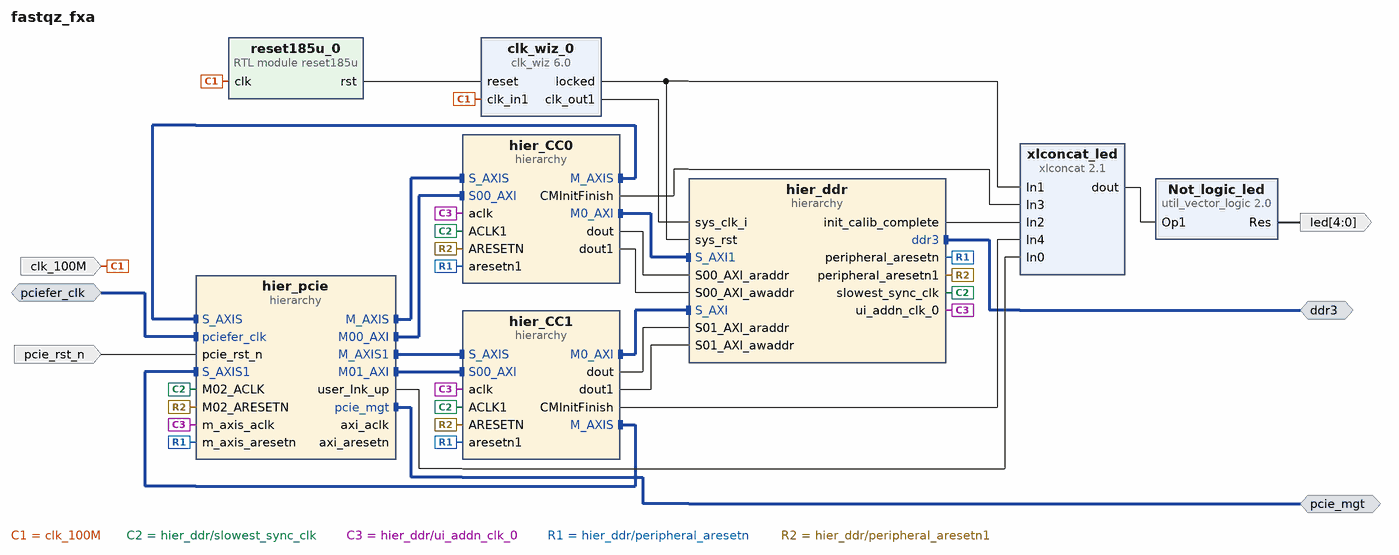
[diagram p0: block diagram of the top level]
# Vivado block design fastqz_fxa, xc7k420tiffg901-2L, Vivado 2018.2
create_bd_design fastqz_fxa

create_bd_intf_port -mode Slave -vlnv xilinx.com:interface:diff_clock_rtl:1.0 pciefer_clk
set_property -dict {CONFIG.FREQ_HZ 100000000} [get_bd_intf_ports pciefer_clk]
create_bd_intf_port -mode Master -vlnv xilinx.com:interface:pcie_7x_mgt_rtl:1.0 pcie_mgt
create_bd_intf_port -mode Master -vlnv xilinx.com:interface:ddrx_rtl:1.0 ddr3
create_bd_port -dir I -type clk clk_100M
create_bd_port -dir I -type rst pcie_rst_n
create_bd_port -dir O -from 4 -to 0 led

create_bd_cell -type ip -vlnv xilinx.com:ip:clk_wiz:6.0 clk_wiz_0
set_property -dict [list \
  CONFIG.CLKOUT1_REQUESTED_OUT_FREQ 200.000 \
  CONFIG.USE_LOCKED true \
  CONFIG.USE_RESET true \
  CONFIG.MMCM_DIVCLK_DIVIDE 1 \
  CONFIG.MMCM_CLKOUT0_DIVIDE_F 5.000 \
  CONFIG.CLKOUT1_JITTER 114.829 \
] [get_bd_cells clk_wiz_0]
create_bd_cell -type module -reference reset185u reset185u_0
create_bd_cell -type hier hier_ddr
create_bd_cell -type hier hier_CC0
create_bd_cell -type hier hier_pcie
create_bd_cell -type ip -vlnv xilinx.com:ip:xlconcat:2.1 xlconcat_led
set_property -dict {CONFIG.NUM_PORTS 5} [get_bd_cells xlconcat_led]
create_bd_cell -type ip -vlnv xilinx.com:ip:util_vector_logic:2.0 Not_logic_led
set_property -dict {CONFIG.C_SIZE 5 CONFIG.C_OPERATION not} [get_bd_cells Not_logic_led]
create_bd_cell -type hier hier_CC1

# ---- hierarchy /hier_ddr ----
current_bd_instance /hier_ddr
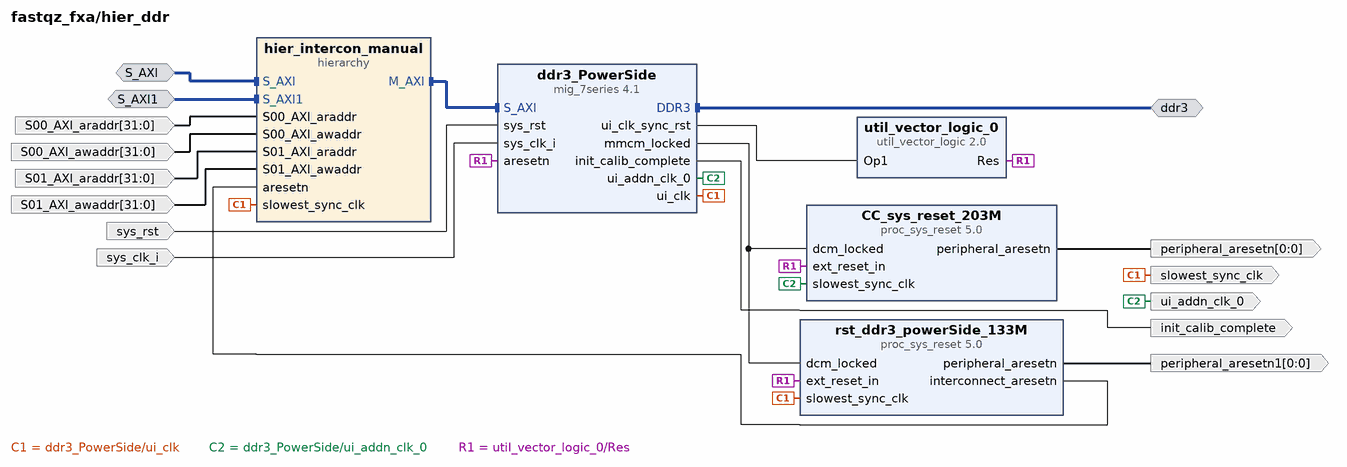
[diagram p1: block diagram inside /hier_ddr]
create_bd_intf_pin -mode Master -vlnv xilinx.com:interface:ddrx_rtl:1.0 ddr3
create_bd_intf_pin -mode Slave -vlnv xilinx.com:interface:aximm_rtl:1.0 S_AXI
create_bd_intf_pin -mode Slave -vlnv xilinx.com:interface:aximm_rtl:1.0 S_AXI1
create_bd_pin -dir O -type clk slowest_sync_clk
create_bd_pin -dir O -type clk ui_addn_clk_0
create_bd_pin -dir I -type clk sys_clk_i
create_bd_pin -dir O -from 0 -to 0 -type rst peripheral_aresetn
create_bd_pin -dir O -from 0 -to 0 -type rst peripheral_aresetn1
create_bd_pin -dir I -type rst sys_rst
create_bd_pin -dir O init_calib_complete
create_bd_pin -dir I -from 31 -to 0 S00_AXI_araddr
create_bd_pin -dir I -from 31 -to 0 S00_AXI_awaddr
create_bd_pin -dir I -from 31 -to 0 S01_AXI_araddr
create_bd_pin -dir I -from 31 -to 0 S01_AXI_awaddr

create_bd_cell -type ip -vlnv xilinx.com:ip:proc_sys_reset:5.0 rst_ddr3_powerSide_133M
create_bd_cell -type ip -vlnv xilinx.com:ip:util_vector_logic:2.0 util_vector_logic_0
set_property -dict {CONFIG.C_SIZE 1 CONFIG.C_OPERATION not} [get_bd_cells util_vector_logic_0]
create_bd_cell -type ip -vlnv xilinx.com:ip:proc_sys_reset:5.0 CC_sys_reset_203M
create_bd_cell -type ip -vlnv xilinx.com:ip:mig_7series:4.1 ddr3_PowerSide
set_property -dict [list \
  CONFIG.XML_INPUT_FILE mig_a.prj \
  CONFIG.RESET_BOARD_INTERFACE Custom \
  CONFIG.BOARD_MIG_PARAM Custom \
] [get_bd_cells ddr3_PowerSide]
create_bd_cell -type hier hier_intercon_manual

# ---- hierarchy /hier_ddr/hier_intercon_manual ----
current_bd_instance /hier_ddr/hier_intercon_manual
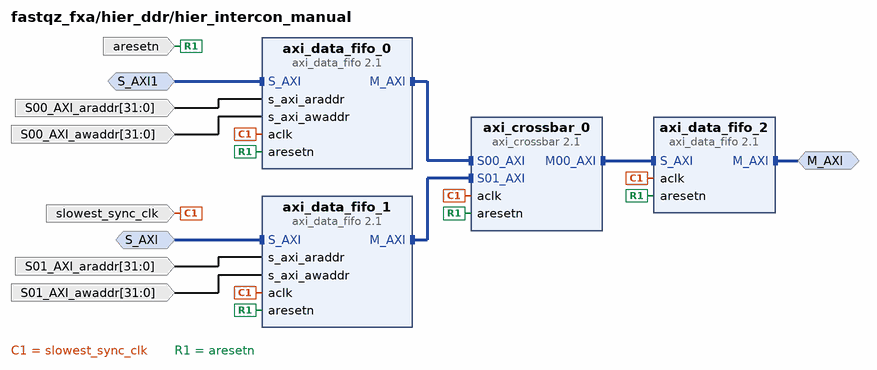
[diagram p2: block diagram inside /hier_ddr/hier_intercon_manual]
create_bd_intf_pin -mode Master -vlnv xilinx.com:interface:aximm_rtl:1.0 M_AXI
create_bd_intf_pin -mode Slave -vlnv xilinx.com:interface:aximm_rtl:1.0 S_AXI
create_bd_intf_pin -mode Slave -vlnv xilinx.com:interface:aximm_rtl:1.0 S_AXI1
create_bd_pin -dir I -from 31 -to 0 S00_AXI_araddr
create_bd_pin -dir I -from 31 -to 0 S00_AXI_awaddr
create_bd_pin -dir I -from 31 -to 0 S01_AXI_araddr
create_bd_pin -dir I -from 31 -to 0 S01_AXI_awaddr
create_bd_pin -dir I -type clk slowest_sync_clk
create_bd_pin -dir I -type rst aresetn

create_bd_cell -type ip -vlnv xilinx.com:ip:axi_crossbar:2.1 axi_crossbar_0
set_property -dict {CONFIG.NUM_SI 2 CONFIG.NUM_MI 1 CONFIG.ADDR_WIDTH 32 CONFIG.DATA_WIDTH 512} [get_bd_cells axi_crossbar_0]
create_bd_cell -type ip -vlnv xilinx.com:ip:axi_data_fifo:2.1 axi_data_fifo_0
set_property -dict {CONFIG.ADDR_WIDTH 32 CONFIG.WRITE_FIFO_DEPTH 32 CONFIG.READ_FIFO_DEPTH 32} [get_bd_cells axi_data_fifo_0]
create_bd_cell -type ip -vlnv xilinx.com:ip:axi_data_fifo:2.1 axi_data_fifo_1
set_property -dict {CONFIG.ADDR_WIDTH 32 CONFIG.WRITE_FIFO_DEPTH 32 CONFIG.READ_FIFO_DEPTH 32} [get_bd_cells axi_data_fifo_1]
create_bd_cell -type ip -vlnv xilinx.com:ip:axi_data_fifo:2.1 axi_data_fifo_2
set_property -dict {CONFIG.WRITE_FIFO_DEPTH 32 CONFIG.READ_FIFO_DEPTH 32} [get_bd_cells axi_data_fifo_2]

# ---- hierarchy /hier_CC0 ----
current_bd_instance /hier_CC0
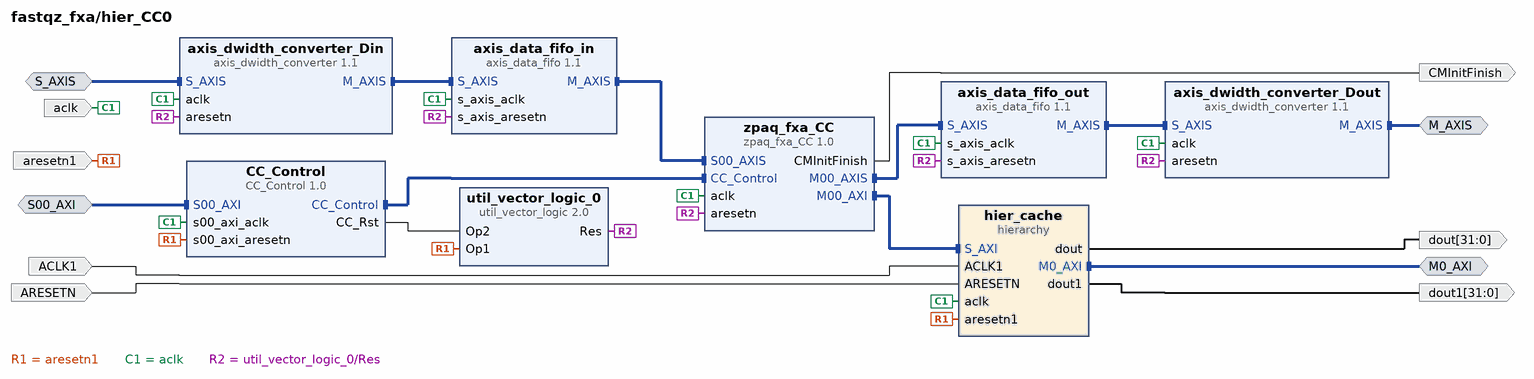
[diagram p3: block diagram inside /hier_CC0]
create_bd_intf_pin -mode Slave -vlnv xilinx.com:interface:axis_rtl:1.0 S_AXIS
create_bd_intf_pin -mode Master -vlnv xilinx.com:interface:axis_rtl:1.0 M_AXIS
create_bd_intf_pin -mode Slave -vlnv xilinx.com:interface:aximm_rtl:1.0 S00_AXI
create_bd_intf_pin -mode Master -vlnv xilinx.com:interface:aximm_rtl:1.0 M0_AXI
create_bd_pin -dir I -type clk aclk
create_bd_pin -dir I -type clk ACLK1
create_bd_pin -dir I -type rst aresetn1
create_bd_pin -dir I -type rst ARESETN
create_bd_pin -dir O CMInitFinish
create_bd_pin -dir O -from 31 -to 0 dout
create_bd_pin -dir O -from 31 -to 0 dout1

create_bd_cell -type ip -vlnv xilinx.com:ip:axis_dwidth_converter:1.1 axis_dwidth_converter_Din
set_property -dict {CONFIG.M_TDATA_NUM_BYTES 1} [get_bd_cells axis_dwidth_converter_Din]
create_bd_cell -type ip -vlnv xilinx.com:ip:axis_dwidth_converter:1.1 axis_dwidth_converter_Dout
set_property -dict {CONFIG.M_TDATA_NUM_BYTES 16} [get_bd_cells axis_dwidth_converter_Dout]
create_bd_cell -type ip -vlnv xilinx.com:ip:axis_data_fifo:1.1 axis_data_fifo_in
set_property -dict {CONFIG.FIFO_DEPTH 256} [get_bd_cells axis_data_fifo_in]
create_bd_cell -type ip -vlnv xilinx.com:ip:axis_data_fifo:1.1 axis_data_fifo_out
set_property -dict {CONFIG.FIFO_DEPTH 4096} [get_bd_cells axis_data_fifo_out]
create_bd_cell -type ip -vlnv xilinx.com:ip:util_vector_logic:2.0 util_vector_logic_0
set_property -dict {CONFIG.C_SIZE 1} [get_bd_cells util_vector_logic_0]
create_bd_cell -type ip -vlnv indigo:fastqz:CC_Control:1.0 CC_Control
create_bd_cell -type hier hier_cache
create_bd_cell -type ip -vlnv indigo:fastqz:zpaq_fxa_CC:1.0 zpaq_fxa_CC
set_property -dict {CONFIG.CMTable_BaseAddr 0x80000000} [get_bd_cells zpaq_fxa_CC]

# ---- hierarchy /hier_CC0/hier_cache ----
current_bd_instance /hier_CC0/hier_cache
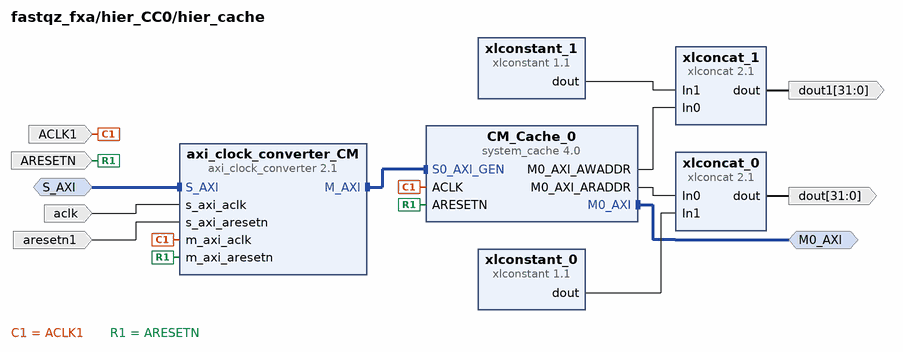
[diagram p4: block diagram inside /hier_CC0/hier_cache]
create_bd_intf_pin -mode Slave -vlnv xilinx.com:interface:aximm_rtl:1.0 S_AXI
create_bd_intf_pin -mode Master -vlnv xilinx.com:interface:aximm_rtl:1.0 M0_AXI
create_bd_pin -dir I -type clk ACLK1
create_bd_pin -dir I -type rst ARESETN
create_bd_pin -dir I -type clk aclk
create_bd_pin -dir I -type rst aresetn1
create_bd_pin -dir O -from 31 -to 0 dout
create_bd_pin -dir O -from 31 -to 0 dout1

create_bd_cell -type ip -vlnv xilinx.com:ip:system_cache:4.0 CM_Cache_0
set_property -dict [list \
  CONFIG.C_NUM_OPTIMIZED_PORTS 0 \
  CONFIG.C_NUM_GENERIC_PORTS 1 \
  CONFIG.C_ENABLE_COHERENCY 0 \
  CONFIG.C_CACHE_DATA_WIDTH 512 \
  CONFIG.C_CACHE_SIZE 524288 \
  CONFIG.C_M0_AXI_ADDR_WIDTH 22 \
  CONFIG.C_M0_AXI_DATA_WIDTH 512 \
] [get_bd_cells CM_Cache_0]
create_bd_cell -type ip -vlnv xilinx.com:ip:xlconstant:1.1 xlconstant_0
set_property -dict {CONFIG.CONST_WIDTH 10 CONFIG.CONST_VAL 512} [get_bd_cells xlconstant_0]
create_bd_cell -type ip -vlnv xilinx.com:ip:axi_clock_converter:2.1 axi_clock_converter_CM
create_bd_cell -type ip -vlnv xilinx.com:ip:xlconcat:2.1 xlconcat_0
create_bd_cell -type ip -vlnv xilinx.com:ip:xlconcat:2.1 xlconcat_1
create_bd_cell -type ip -vlnv xilinx.com:ip:xlconstant:1.1 xlconstant_1
set_property -dict {CONFIG.CONST_WIDTH 10 CONFIG.CONST_VAL 512} [get_bd_cells xlconstant_1]

# ---- hierarchy /hier_pcie ----
current_bd_instance /hier_pcie
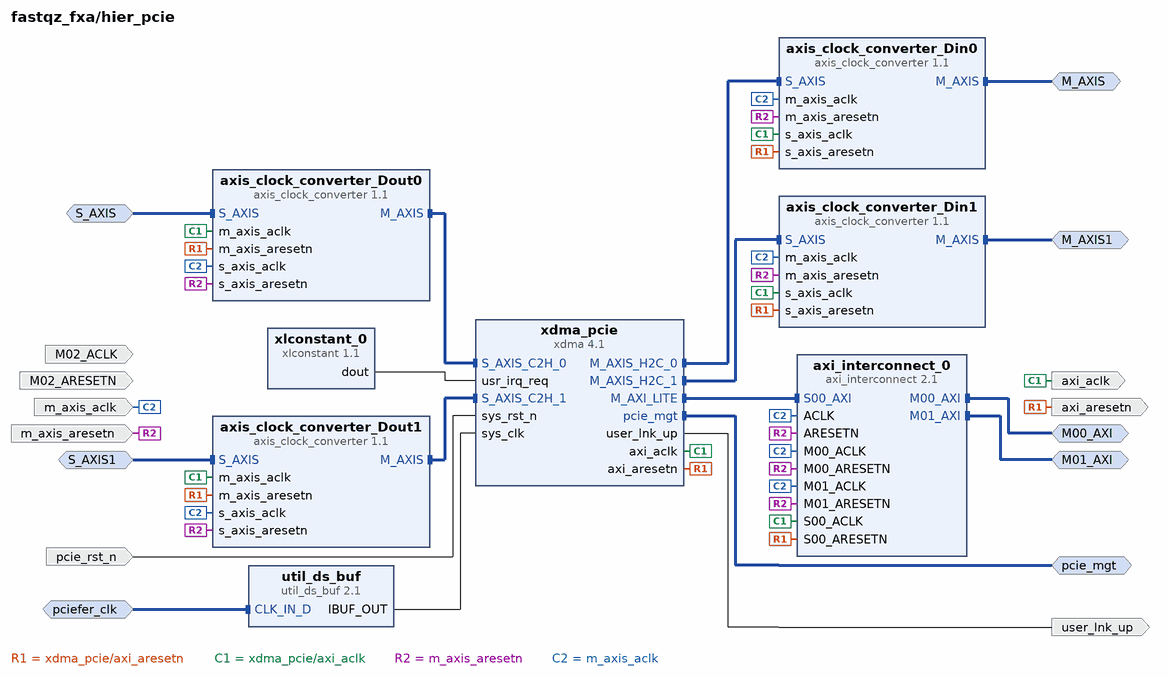
[diagram p5: block diagram inside /hier_pcie]
create_bd_intf_pin -mode Slave -vlnv xilinx.com:interface:diff_clock_rtl:1.0 pciefer_clk
create_bd_intf_pin -mode Master -vlnv xilinx.com:interface:pcie_7x_mgt_rtl:1.0 pcie_mgt
create_bd_intf_pin -mode Master -vlnv xilinx.com:interface:axis_rtl:1.0 M_AXIS
create_bd_intf_pin -mode Slave -vlnv xilinx.com:interface:axis_rtl:1.0 S_AXIS
create_bd_intf_pin -mode Master -vlnv xilinx.com:interface:axis_rtl:1.0 M_AXIS1
create_bd_intf_pin -mode Slave -vlnv xilinx.com:interface:axis_rtl:1.0 S_AXIS1
create_bd_intf_pin -mode Master -vlnv xilinx.com:interface:aximm_rtl:1.0 M00_AXI
create_bd_intf_pin -mode Master -vlnv xilinx.com:interface:aximm_rtl:1.0 M01_AXI
create_bd_pin -dir I -type rst m_axis_aresetn
create_bd_pin -dir I -type clk m_axis_aclk
create_bd_pin -dir I -type rst pcie_rst_n
create_bd_pin -dir O user_lnk_up
create_bd_pin -dir I -type clk M02_ACLK
create_bd_pin -dir I -type rst M02_ARESETN
create_bd_pin -dir O -type clk axi_aclk
create_bd_pin -dir O -type rst axi_aresetn

create_bd_cell -type ip -vlnv xilinx.com:ip:util_ds_buf:2.1 util_ds_buf
set_property -dict {CONFIG.C_BUF_TYPE IBUFDSGTE} [get_bd_cells util_ds_buf]
create_bd_cell -type ip -vlnv xilinx.com:ip:axis_clock_converter:1.1 axis_clock_converter_Dout0
create_bd_cell -type ip -vlnv xilinx.com:ip:xdma:4.1 xdma_pcie
set_property -dict [list \
  CONFIG.mode_selection Advanced \
  CONFIG.pl_link_cap_max_link_width X4 \
  CONFIG.pl_link_cap_max_link_speed 5.0_GT/s \
  CONFIG.ref_clk_freq 100_MHz \
  CONFIG.axi_data_width 128_bit \
  CONFIG.axisten_freq 125 \
  CONFIG.pf0_device_id 7024 \
  CONFIG.pf0_class_code_base 05 \
  CONFIG.pf0_sub_class_interface_menu Generic_XT_compatible_serial_controller \
  CONFIG.pf0_class_code_sub 80 \
  CONFIG.pf0_class_code_interface 00 \
  CONFIG.axilite_master_en true \
  CONFIG.pciebar2axibar_axil_master 0x44A00000 \
  CONFIG.xdma_rnum_chnl 2 \
  CONFIG.xdma_wnum_chnl 2 \
  CONFIG.plltype QPLL1 \
  CONFIG.xdma_axi_intf_mm AXI_Stream \
  CONFIG.performance false \
  CONFIG.cfg_mgmt_if false \
  CONFIG.axil_master_64bit_en false \
  CONFIG.PF0_DEVICE_ID_mqdma 9024 \
  CONFIG.PF2_DEVICE_ID_mqdma 9024 \
  CONFIG.PF3_DEVICE_ID_mqdma 9024 \
] [get_bd_cells xdma_pcie]
create_bd_cell -type ip -vlnv xilinx.com:ip:axis_clock_converter:1.1 axis_clock_converter_Din0
create_bd_cell -type ip -vlnv xilinx.com:ip:xlconstant:1.1 xlconstant_0
set_property -dict {CONFIG.CONST_VAL 0} [get_bd_cells xlconstant_0]
create_bd_cell -type ip -vlnv xilinx.com:ip:axis_clock_converter:1.1 axis_clock_converter_Dout1
create_bd_cell -type ip -vlnv xilinx.com:ip:axis_clock_converter:1.1 axis_clock_converter_Din1
create_bd_cell -type ip -vlnv xilinx.com:ip:axi_interconnect:2.1 axi_interconnect_0
set_property -dict {CONFIG.NUM_MI 2} [get_bd_cells axi_interconnect_0]

# ---- hierarchy /hier_CC1 ----
current_bd_instance /hier_CC1
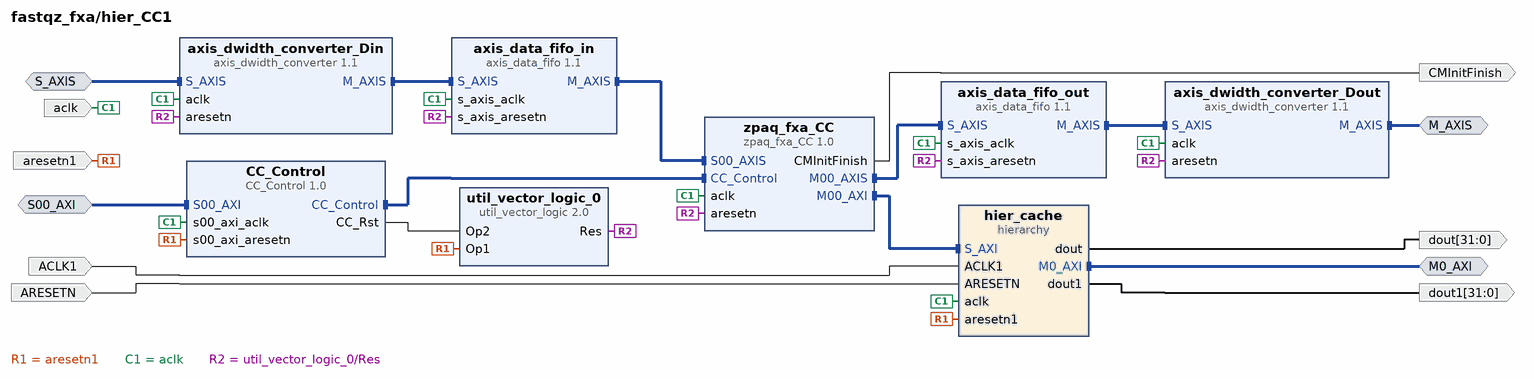
[diagram p6: block diagram inside /hier_CC1]
create_bd_intf_pin -mode Slave -vlnv xilinx.com:interface:axis_rtl:1.0 S_AXIS
create_bd_intf_pin -mode Master -vlnv xilinx.com:interface:axis_rtl:1.0 M_AXIS
create_bd_intf_pin -mode Slave -vlnv xilinx.com:interface:aximm_rtl:1.0 S00_AXI
create_bd_intf_pin -mode Master -vlnv xilinx.com:interface:aximm_rtl:1.0 M0_AXI
create_bd_pin -dir I -type clk aclk
create_bd_pin -dir I -type clk ACLK1
create_bd_pin -dir I -type rst aresetn1
create_bd_pin -dir I -type rst ARESETN
create_bd_pin -dir O CMInitFinish
create_bd_pin -dir O -from 31 -to 0 dout
create_bd_pin -dir O -from 31 -to 0 dout1

create_bd_cell -type ip -vlnv xilinx.com:ip:axis_dwidth_converter:1.1 axis_dwidth_converter_Din
set_property -dict {CONFIG.M_TDATA_NUM_BYTES 1} [get_bd_cells axis_dwidth_converter_Din]
create_bd_cell -type ip -vlnv xilinx.com:ip:axis_data_fifo:1.1 axis_data_fifo_in
set_property -dict {CONFIG.FIFO_DEPTH 256} [get_bd_cells axis_data_fifo_in]
create_bd_cell -type ip -vlnv xilinx.com:ip:axis_data_fifo:1.1 axis_data_fifo_out
set_property -dict {CONFIG.FIFO_DEPTH 4096} [get_bd_cells axis_data_fifo_out]
create_bd_cell -type ip -vlnv xilinx.com:ip:util_vector_logic:2.0 util_vector_logic_0
set_property -dict {CONFIG.C_SIZE 1} [get_bd_cells util_vector_logic_0]
create_bd_cell -type ip -vlnv indigo:fastqz:CC_Control:1.0 CC_Control
create_bd_cell -type hier hier_cache
create_bd_cell -type ip -vlnv xilinx.com:ip:axis_dwidth_converter:1.1 axis_dwidth_converter_Dout
set_property -dict {CONFIG.M_TDATA_NUM_BYTES 16} [get_bd_cells axis_dwidth_converter_Dout]
create_bd_cell -type ip -vlnv indigo:fastqz:zpaq_fxa_CC:1.0 zpaq_fxa_CC
set_property -dict {CONFIG.CMTable_BaseAddr 0x80400000} [get_bd_cells zpaq_fxa_CC]

# ---- hierarchy /hier_CC1/hier_cache ----
current_bd_instance /hier_CC1/hier_cache
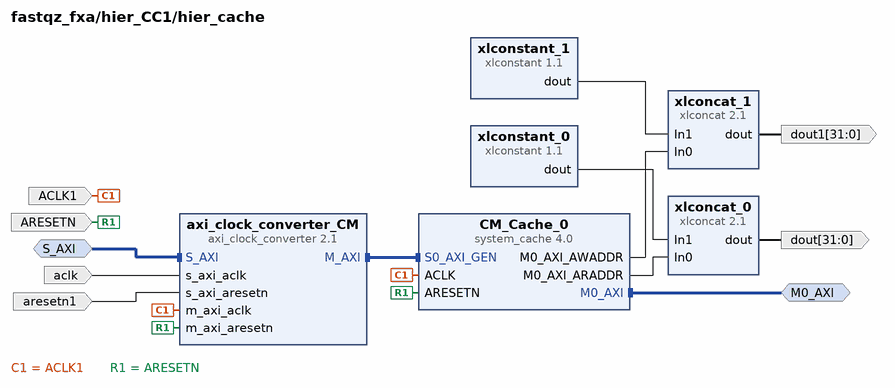
[diagram p7: block diagram inside /hier_CC1/hier_cache]
create_bd_intf_pin -mode Slave -vlnv xilinx.com:interface:aximm_rtl:1.0 S_AXI
create_bd_intf_pin -mode Master -vlnv xilinx.com:interface:aximm_rtl:1.0 M0_AXI
create_bd_pin -dir I -type clk ACLK1
create_bd_pin -dir I -type rst ARESETN
create_bd_pin -dir I -type clk aclk
create_bd_pin -dir I -type rst aresetn1
create_bd_pin -dir O -from 31 -to 0 dout
create_bd_pin -dir O -from 31 -to 0 dout1

create_bd_cell -type ip -vlnv xilinx.com:ip:system_cache:4.0 CM_Cache_0
set_property -dict [list \
  CONFIG.C_NUM_OPTIMIZED_PORTS 0 \
  CONFIG.C_NUM_GENERIC_PORTS 1 \
  CONFIG.C_ENABLE_COHERENCY 0 \
  CONFIG.C_CACHE_DATA_WIDTH 512 \
  CONFIG.C_CACHE_SIZE 524288 \
  CONFIG.C_M0_AXI_ADDR_WIDTH 22 \
  CONFIG.C_M0_AXI_DATA_WIDTH 512 \
] [get_bd_cells CM_Cache_0]
create_bd_cell -type ip -vlnv xilinx.com:ip:xlconstant:1.1 xlconstant_0
set_property -dict {CONFIG.CONST_WIDTH 10 CONFIG.CONST_VAL 513} [get_bd_cells xlconstant_0]
create_bd_cell -type ip -vlnv xilinx.com:ip:axi_clock_converter:2.1 axi_clock_converter_CM
create_bd_cell -type ip -vlnv xilinx.com:ip:xlconcat:2.1 xlconcat_0
create_bd_cell -type ip -vlnv xilinx.com:ip:xlconcat:2.1 xlconcat_1
create_bd_cell -type ip -vlnv xilinx.com:ip:xlconstant:1.1 xlconstant_1
set_property -dict {CONFIG.CONST_WIDTH 10 CONFIG.CONST_VAL 513} [get_bd_cells xlconstant_1]

# ---- connections ----

current_bd_instance /hier_ddr
connect_bd_intf_net [get_bd_intf_pins ddr3_PowerSide/S_AXI] [get_bd_intf_pins hier_intercon_manual/M_AXI]
connect_bd_intf_net [get_bd_intf_pins ddr3] [get_bd_intf_pins ddr3_PowerSide/DDR3]
connect_bd_intf_net [get_bd_intf_pins S_AXI] [get_bd_intf_pins hier_intercon_manual/S_AXI]
connect_bd_intf_net [get_bd_intf_pins S_AXI1] [get_bd_intf_pins hier_intercon_manual/S_AXI1]
connect_bd_net [get_bd_pins rst_ddr3_powerSide_133M/peripheral_aresetn] [get_bd_pins peripheral_aresetn1]
connect_bd_net [get_bd_pins ddr3_PowerSide/ui_clk] \
  [get_bd_pins slowest_sync_clk] [get_bd_pins rst_ddr3_powerSide_133M/slowest_sync_clk] \
  [get_bd_pins hier_intercon_manual/slowest_sync_clk]
connect_bd_net [get_bd_pins ddr3_PowerSide/ui_addn_clk_0] [get_bd_pins ui_addn_clk_0] [get_bd_pins CC_sys_reset_203M/slowest_sync_clk]
connect_bd_net [get_bd_pins ddr3_PowerSide/mmcm_locked] [get_bd_pins rst_ddr3_powerSide_133M/dcm_locked] [get_bd_pins CC_sys_reset_203M/dcm_locked]
connect_bd_net [get_bd_pins util_vector_logic_0/Res] \
  [get_bd_pins rst_ddr3_powerSide_133M/ext_reset_in] [get_bd_pins CC_sys_reset_203M/ext_reset_in] \
  [get_bd_pins ddr3_PowerSide/aresetn]
connect_bd_net -net CC_sys_reset_200M_peripheral_aresetn [get_bd_pins CC_sys_reset_203M/peripheral_aresetn] [get_bd_pins peripheral_aresetn]
connect_bd_net [get_bd_pins sys_rst] [get_bd_pins ddr3_PowerSide/sys_rst]
connect_bd_net [get_bd_pins sys_clk_i] [get_bd_pins ddr3_PowerSide/sys_clk_i]
connect_bd_net -net mig_7series_0_ui_clk_sync_rst [get_bd_pins ddr3_PowerSide/ui_clk_sync_rst] [get_bd_pins util_vector_logic_0/Op1]
connect_bd_net -net mig_7series_0_init_calib_complete [get_bd_pins ddr3_PowerSide/init_calib_complete] [get_bd_pins init_calib_complete]
connect_bd_net [get_bd_pins S00_AXI_araddr] [get_bd_pins hier_intercon_manual/S00_AXI_araddr]
connect_bd_net [get_bd_pins S00_AXI_awaddr] [get_bd_pins hier_intercon_manual/S00_AXI_awaddr]
connect_bd_net [get_bd_pins S01_AXI_araddr] [get_bd_pins hier_intercon_manual/S01_AXI_araddr]
connect_bd_net [get_bd_pins S01_AXI_awaddr] [get_bd_pins hier_intercon_manual/S01_AXI_awaddr]
connect_bd_net [get_bd_pins rst_ddr3_powerSide_133M/interconnect_aresetn] [get_bd_pins hier_intercon_manual/aresetn]

current_bd_instance /hier_ddr/hier_intercon_manual
connect_bd_intf_net [get_bd_intf_pins axi_data_fifo_0/M_AXI] [get_bd_intf_pins axi_crossbar_0/S00_AXI]
connect_bd_intf_net [get_bd_intf_pins axi_data_fifo_1/M_AXI] [get_bd_intf_pins axi_crossbar_0/S01_AXI]
connect_bd_intf_net [get_bd_intf_pins axi_crossbar_0/M00_AXI] [get_bd_intf_pins axi_data_fifo_2/S_AXI]
connect_bd_intf_net [get_bd_intf_pins M_AXI] [get_bd_intf_pins axi_data_fifo_2/M_AXI]
connect_bd_intf_net [get_bd_intf_pins S_AXI] [get_bd_intf_pins axi_data_fifo_1/S_AXI]
connect_bd_intf_net [get_bd_intf_pins S_AXI1] [get_bd_intf_pins axi_data_fifo_0/S_AXI]
connect_bd_net [get_bd_pins S00_AXI_araddr] [get_bd_pins axi_data_fifo_0/s_axi_araddr]
connect_bd_net [get_bd_pins S00_AXI_awaddr] [get_bd_pins axi_data_fifo_0/s_axi_awaddr]
connect_bd_net [get_bd_pins S01_AXI_araddr] [get_bd_pins axi_data_fifo_1/s_axi_araddr]
connect_bd_net [get_bd_pins S01_AXI_awaddr] [get_bd_pins axi_data_fifo_1/s_axi_awaddr]
connect_bd_net [get_bd_pins slowest_sync_clk] \
  [get_bd_pins axi_data_fifo_0/aclk] [get_bd_pins axi_data_fifo_1/aclk] [get_bd_pins axi_data_fifo_2/aclk] \
  [get_bd_pins axi_crossbar_0/aclk]
connect_bd_net [get_bd_pins aresetn] \
  [get_bd_pins axi_data_fifo_0/aresetn] [get_bd_pins axi_data_fifo_1/aresetn] [get_bd_pins axi_data_fifo_2/aresetn] \
  [get_bd_pins axi_crossbar_0/aresetn]

current_bd_instance /hier_CC0
connect_bd_intf_net [get_bd_intf_pins zpaq_fxa_CC/M00_AXI] [get_bd_intf_pins hier_cache/S_AXI]
connect_bd_intf_net [get_bd_intf_pins axis_dwidth_converter_Din/M_AXIS] [get_bd_intf_pins axis_data_fifo_in/S_AXIS]
connect_bd_intf_net [get_bd_intf_pins axis_data_fifo_in/M_AXIS] [get_bd_intf_pins zpaq_fxa_CC/S00_AXIS]
connect_bd_intf_net [get_bd_intf_pins zpaq_fxa_CC/M00_AXIS] [get_bd_intf_pins axis_data_fifo_out/S_AXIS]
connect_bd_intf_net [get_bd_intf_pins axis_data_fifo_out/M_AXIS] [get_bd_intf_pins axis_dwidth_converter_Dout/S_AXIS]
connect_bd_intf_net [get_bd_intf_pins CC_Control/CC_Control] [get_bd_intf_pins zpaq_fxa_CC/CC_Control]
connect_bd_intf_net [get_bd_intf_pins S_AXIS] [get_bd_intf_pins axis_dwidth_converter_Din/S_AXIS]
connect_bd_intf_net [get_bd_intf_pins M_AXIS] [get_bd_intf_pins axis_dwidth_converter_Dout/M_AXIS]
connect_bd_intf_net [get_bd_intf_pins S00_AXI] [get_bd_intf_pins CC_Control/S00_AXI]
connect_bd_intf_net [get_bd_intf_pins M0_AXI] [get_bd_intf_pins hier_cache/M0_AXI]
connect_bd_net [get_bd_pins aresetn1] [get_bd_pins util_vector_logic_0/Op1] [get_bd_pins CC_Control/s00_axi_aresetn] [get_bd_pins hier_cache/aresetn1]
connect_bd_net [get_bd_pins aclk] \
  [get_bd_pins axis_dwidth_converter_Din/aclk] [get_bd_pins axis_dwidth_converter_Dout/aclk] \
  [get_bd_pins axis_data_fifo_in/s_axis_aclk] [get_bd_pins axis_data_fifo_out/s_axis_aclk] \
  [get_bd_pins CC_Control/s00_axi_aclk] [get_bd_pins hier_cache/aclk] [get_bd_pins zpaq_fxa_CC/aclk]
connect_bd_net -net ddr3_powerSide_ui_clk [get_bd_pins ACLK1] [get_bd_pins hier_cache/ACLK1]
connect_bd_net -net rst_ddr3_powerSide_133M_interconnect_aresetn [get_bd_pins ARESETN] [get_bd_pins hier_cache/ARESETN]
connect_bd_net [get_bd_pins util_vector_logic_0/Res] \
  [get_bd_pins axis_dwidth_converter_Din/aresetn] [get_bd_pins axis_data_fifo_in/s_axis_aresetn] \
  [get_bd_pins axis_data_fifo_out/s_axis_aresetn] [get_bd_pins axis_dwidth_converter_Dout/aresetn] \
  [get_bd_pins zpaq_fxa_CC/aresetn]
connect_bd_net [get_bd_pins zpaq_fxa_CC/CMInitFinish] [get_bd_pins CMInitFinish]
connect_bd_net [get_bd_pins CC_Control/CC_Rst] [get_bd_pins util_vector_logic_0/Op2]
connect_bd_net [get_bd_pins hier_cache/dout] [get_bd_pins dout]
connect_bd_net [get_bd_pins hier_cache/dout1] [get_bd_pins dout1]

current_bd_instance /hier_CC0/hier_cache
connect_bd_intf_net [get_bd_intf_pins axi_clock_converter_CM/M_AXI] [get_bd_intf_pins CM_Cache_0/S0_AXI_GEN]
connect_bd_intf_net [get_bd_intf_pins S_AXI] [get_bd_intf_pins axi_clock_converter_CM/S_AXI]
connect_bd_intf_net [get_bd_intf_pins M0_AXI] [get_bd_intf_pins CM_Cache_0/M0_AXI]
connect_bd_net [get_bd_pins CM_Cache_0/M0_AXI_ARADDR] [get_bd_pins xlconcat_0/In0]
connect_bd_net [get_bd_pins xlconstant_0/dout] [get_bd_pins xlconcat_0/In1]
connect_bd_net -net ddr3_powerSide_ui_clk [get_bd_pins ACLK1] [get_bd_pins axi_clock_converter_CM/m_axi_aclk] [get_bd_pins CM_Cache_0/ACLK]
connect_bd_net -net rst_ddr3_powerSide_133M_interconnect_aresetn [get_bd_pins ARESETN] \
  [get_bd_pins axi_clock_converter_CM/m_axi_aresetn] [get_bd_pins CM_Cache_0/ARESETN]
connect_bd_net [get_bd_pins aclk] [get_bd_pins axi_clock_converter_CM/s_axi_aclk]
connect_bd_net [get_bd_pins aresetn1] [get_bd_pins axi_clock_converter_CM/s_axi_aresetn]
connect_bd_net [get_bd_pins xlconstant_1/dout] [get_bd_pins xlconcat_1/In1]
connect_bd_net [get_bd_pins CM_Cache_0/M0_AXI_AWADDR] [get_bd_pins xlconcat_1/In0]
connect_bd_net [get_bd_pins xlconcat_0/dout] [get_bd_pins dout]
connect_bd_net [get_bd_pins xlconcat_1/dout] [get_bd_pins dout1]

current_bd_instance /hier_pcie
connect_bd_intf_net [get_bd_intf_pins xdma_pcie/M_AXIS_H2C_0] [get_bd_intf_pins axis_clock_converter_Din0/S_AXIS]
connect_bd_intf_net [get_bd_intf_pins xdma_pcie/M_AXI_LITE] [get_bd_intf_pins axi_interconnect_0/S00_AXI]
connect_bd_intf_net [get_bd_intf_pins xdma_pcie/S_AXIS_C2H_0] [get_bd_intf_pins axis_clock_converter_Dout0/M_AXIS]
connect_bd_intf_net [get_bd_intf_pins xdma_pcie/M_AXIS_H2C_1] [get_bd_intf_pins axis_clock_converter_Din1/S_AXIS]
connect_bd_intf_net [get_bd_intf_pins axis_clock_converter_Dout1/M_AXIS] [get_bd_intf_pins xdma_pcie/S_AXIS_C2H_1]
connect_bd_intf_net [get_bd_intf_pins pciefer_clk] [get_bd_intf_pins util_ds_buf/CLK_IN_D]
connect_bd_intf_net [get_bd_intf_pins pcie_mgt] [get_bd_intf_pins xdma_pcie/pcie_mgt]
connect_bd_intf_net [get_bd_intf_pins M_AXIS] [get_bd_intf_pins axis_clock_converter_Din0/M_AXIS]
connect_bd_intf_net [get_bd_intf_pins S_AXIS] [get_bd_intf_pins axis_clock_converter_Dout0/S_AXIS]
connect_bd_intf_net [get_bd_intf_pins M_AXIS1] [get_bd_intf_pins axis_clock_converter_Din1/M_AXIS]
connect_bd_intf_net [get_bd_intf_pins S_AXIS1] [get_bd_intf_pins axis_clock_converter_Dout1/S_AXIS]
connect_bd_intf_net [get_bd_intf_pins M00_AXI] [get_bd_intf_pins axi_interconnect_0/M00_AXI]
connect_bd_intf_net [get_bd_intf_pins M01_AXI] [get_bd_intf_pins axi_interconnect_0/M01_AXI]
connect_bd_net -net util_ds_buf_0_IBUF_OUT [get_bd_pins util_ds_buf/IBUF_OUT] [get_bd_pins xdma_pcie/sys_clk]
connect_bd_net [get_bd_pins xdma_pcie/axi_aresetn] \
  [get_bd_pins axi_aresetn] [get_bd_pins axis_clock_converter_Dout0/m_axis_aresetn] \
  [get_bd_pins axis_clock_converter_Din0/s_axis_aresetn] [get_bd_pins axis_clock_converter_Din1/s_axis_aresetn] \
  [get_bd_pins axis_clock_converter_Dout1/m_axis_aresetn] [get_bd_pins axi_interconnect_0/S00_ARESETN]
connect_bd_net [get_bd_pins xdma_pcie/axi_aclk] \
  [get_bd_pins axi_aclk] [get_bd_pins axis_clock_converter_Dout0/m_axis_aclk] \
  [get_bd_pins axis_clock_converter_Din0/s_axis_aclk] [get_bd_pins axis_clock_converter_Din1/s_axis_aclk] \
  [get_bd_pins axis_clock_converter_Dout1/m_axis_aclk] [get_bd_pins axi_interconnect_0/S00_ACLK]
connect_bd_net [get_bd_pins m_axis_aresetn] \
  [get_bd_pins axis_clock_converter_Din0/m_axis_aresetn] [get_bd_pins axis_clock_converter_Dout0/s_axis_aresetn] \
  [get_bd_pins axis_clock_converter_Din1/m_axis_aresetn] [get_bd_pins axis_clock_converter_Dout1/s_axis_aresetn] \
  [get_bd_pins axi_interconnect_0/M00_ARESETN] [get_bd_pins axi_interconnect_0/ARESETN] \
  [get_bd_pins axi_interconnect_0/M01_ARESETN]
connect_bd_net [get_bd_pins m_axis_aclk] \
  [get_bd_pins axis_clock_converter_Din0/m_axis_aclk] [get_bd_pins axis_clock_converter_Dout0/s_axis_aclk] \
  [get_bd_pins axis_clock_converter_Din1/m_axis_aclk] [get_bd_pins axis_clock_converter_Dout1/s_axis_aclk] \
  [get_bd_pins axi_interconnect_0/M00_ACLK] [get_bd_pins axi_interconnect_0/ACLK] [get_bd_pins axi_interconnect_0/M01_ACLK]
connect_bd_net -net sys_rst_n_0_1 [get_bd_pins pcie_rst_n] [get_bd_pins xdma_pcie/sys_rst_n]
connect_bd_net [get_bd_pins xlconstant_0/dout] [get_bd_pins xdma_pcie/usr_irq_req]
connect_bd_net [get_bd_pins xdma_pcie/user_lnk_up] [get_bd_pins user_lnk_up]

current_bd_instance /hier_CC1
connect_bd_intf_net [get_bd_intf_pins zpaq_fxa_CC/M00_AXI] [get_bd_intf_pins hier_cache/S_AXI]
connect_bd_intf_net [get_bd_intf_pins axis_dwidth_converter_Din/M_AXIS] [get_bd_intf_pins axis_data_fifo_in/S_AXIS]
connect_bd_intf_net [get_bd_intf_pins axis_data_fifo_in/M_AXIS] [get_bd_intf_pins zpaq_fxa_CC/S00_AXIS]
connect_bd_intf_net [get_bd_intf_pins zpaq_fxa_CC/M00_AXIS] [get_bd_intf_pins axis_data_fifo_out/S_AXIS]
connect_bd_intf_net [get_bd_intf_pins CC_Control/CC_Control] [get_bd_intf_pins zpaq_fxa_CC/CC_Control]
connect_bd_intf_net [get_bd_intf_pins axis_data_fifo_out/M_AXIS] [get_bd_intf_pins axis_dwidth_converter_Dout/S_AXIS]
connect_bd_intf_net [get_bd_intf_pins S_AXIS] [get_bd_intf_pins axis_dwidth_converter_Din/S_AXIS]
connect_bd_intf_net [get_bd_intf_pins M_AXIS] [get_bd_intf_pins axis_dwidth_converter_Dout/M_AXIS]
connect_bd_intf_net [get_bd_intf_pins S00_AXI] [get_bd_intf_pins CC_Control/S00_AXI]
connect_bd_intf_net [get_bd_intf_pins M0_AXI] [get_bd_intf_pins hier_cache/M0_AXI]
connect_bd_net [get_bd_pins aresetn1] [get_bd_pins util_vector_logic_0/Op1] [get_bd_pins CC_Control/s00_axi_aresetn] [get_bd_pins hier_cache/aresetn1]
connect_bd_net [get_bd_pins aclk] \
  [get_bd_pins axis_dwidth_converter_Din/aclk] [get_bd_pins axis_data_fifo_in/s_axis_aclk] \
  [get_bd_pins axis_data_fifo_out/s_axis_aclk] [get_bd_pins CC_Control/s00_axi_aclk] \
  [get_bd_pins axis_dwidth_converter_Dout/aclk] [get_bd_pins hier_cache/aclk] [get_bd_pins zpaq_fxa_CC/aclk]
connect_bd_net -net ddr3_powerSide_ui_clk [get_bd_pins ACLK1] [get_bd_pins hier_cache/ACLK1]
connect_bd_net -net rst_ddr3_powerSide_133M_interconnect_aresetn [get_bd_pins ARESETN] [get_bd_pins hier_cache/ARESETN]
connect_bd_net [get_bd_pins util_vector_logic_0/Res] \
  [get_bd_pins axis_dwidth_converter_Din/aresetn] [get_bd_pins axis_data_fifo_in/s_axis_aresetn] \
  [get_bd_pins axis_data_fifo_out/s_axis_aresetn] [get_bd_pins axis_dwidth_converter_Dout/aresetn] \
  [get_bd_pins zpaq_fxa_CC/aresetn]
connect_bd_net [get_bd_pins zpaq_fxa_CC/CMInitFinish] [get_bd_pins CMInitFinish]
connect_bd_net [get_bd_pins CC_Control/CC_Rst] [get_bd_pins util_vector_logic_0/Op2]
connect_bd_net [get_bd_pins hier_cache/dout] [get_bd_pins dout]
connect_bd_net [get_bd_pins hier_cache/dout1] [get_bd_pins dout1]

current_bd_instance /hier_CC1/hier_cache
connect_bd_intf_net [get_bd_intf_pins axi_clock_converter_CM/M_AXI] [get_bd_intf_pins CM_Cache_0/S0_AXI_GEN]
connect_bd_intf_net [get_bd_intf_pins S_AXI] [get_bd_intf_pins axi_clock_converter_CM/S_AXI]
connect_bd_intf_net [get_bd_intf_pins M0_AXI] [get_bd_intf_pins CM_Cache_0/M0_AXI]
connect_bd_net [get_bd_pins xlconstant_0/dout] [get_bd_pins xlconcat_0/In1]
connect_bd_net -net ddr3_powerSide_ui_clk [get_bd_pins ACLK1] [get_bd_pins axi_clock_converter_CM/m_axi_aclk] [get_bd_pins CM_Cache_0/ACLK]
connect_bd_net -net rst_ddr3_powerSide_133M_interconnect_aresetn [get_bd_pins ARESETN] \
  [get_bd_pins axi_clock_converter_CM/m_axi_aresetn] [get_bd_pins CM_Cache_0/ARESETN]
connect_bd_net [get_bd_pins aclk] [get_bd_pins axi_clock_converter_CM/s_axi_aclk]
connect_bd_net [get_bd_pins aresetn1] [get_bd_pins axi_clock_converter_CM/s_axi_aresetn]
connect_bd_net [get_bd_pins xlconstant_1/dout] [get_bd_pins xlconcat_1/In1]
connect_bd_net [get_bd_pins CM_Cache_0/M0_AXI_ARADDR] [get_bd_pins xlconcat_0/In0]
connect_bd_net [get_bd_pins CM_Cache_0/M0_AXI_AWADDR] [get_bd_pins xlconcat_1/In0]
connect_bd_net [get_bd_pins xlconcat_0/dout] [get_bd_pins dout]
connect_bd_net [get_bd_pins xlconcat_1/dout] [get_bd_pins dout1]

current_bd_instance /
connect_bd_intf_net [get_bd_intf_pins hier_pcie/M_AXIS] [get_bd_intf_pins hier_CC0/S_AXIS]
connect_bd_intf_net [get_bd_intf_pins hier_CC0/M_AXIS] [get_bd_intf_pins hier_pcie/S_AXIS]
connect_bd_intf_net [get_bd_intf_pins hier_CC1/S_AXIS] [get_bd_intf_pins hier_pcie/M_AXIS1]
connect_bd_intf_net [get_bd_intf_pins hier_CC1/M_AXIS] [get_bd_intf_pins hier_pcie/S_AXIS1]
connect_bd_intf_net [get_bd_intf_pins hier_CC0/S00_AXI] [get_bd_intf_pins hier_pcie/M00_AXI]
connect_bd_intf_net [get_bd_intf_pins hier_CC1/S00_AXI] [get_bd_intf_pins hier_pcie/M01_AXI]
connect_bd_intf_net [get_bd_intf_pins hier_CC1/M0_AXI] [get_bd_intf_pins hier_ddr/S_AXI]
connect_bd_intf_net [get_bd_intf_pins hier_CC0/M0_AXI] [get_bd_intf_pins hier_ddr/S_AXI1]
connect_bd_intf_net [get_bd_intf_ports pciefer_clk] [get_bd_intf_pins hier_pcie/pciefer_clk]
connect_bd_intf_net [get_bd_intf_ports pcie_mgt] [get_bd_intf_pins hier_pcie/pcie_mgt]
connect_bd_intf_net [get_bd_intf_ports ddr3] [get_bd_intf_pins hier_ddr/ddr3]
connect_bd_net -net clk_in1_0_1 [get_bd_ports clk_100M] [get_bd_pins clk_wiz_0/clk_in1] [get_bd_pins reset185u_0/clk]
connect_bd_net [get_bd_pins clk_wiz_0/clk_out1] [get_bd_pins hier_ddr/sys_clk_i]
connect_bd_net [get_bd_pins reset185u_0/rst] [get_bd_pins clk_wiz_0/reset]
connect_bd_net -net ddr3_powerSide_ui_clk [get_bd_pins hier_ddr/slowest_sync_clk] \
  [get_bd_pins hier_CC0/ACLK1] [get_bd_pins hier_CC1/ACLK1] [get_bd_pins hier_pcie/M02_ACLK]
connect_bd_net [get_bd_pins hier_ddr/ui_addn_clk_0] [get_bd_pins hier_CC0/aclk] [get_bd_pins hier_pcie/m_axis_aclk] [get_bd_pins hier_CC1/aclk]
connect_bd_net [get_bd_ports pcie_rst_n] [get_bd_pins hier_pcie/pcie_rst_n]
connect_bd_net -net aresetn1_1 [get_bd_pins hier_ddr/peripheral_aresetn] \
  [get_bd_pins hier_CC0/aresetn1] [get_bd_pins hier_pcie/m_axis_aresetn] [get_bd_pins hier_CC1/aresetn1]
connect_bd_net -net M01_ARESETN1_1 [get_bd_pins hier_ddr/peripheral_aresetn1] \
  [get_bd_pins hier_CC0/ARESETN] [get_bd_pins hier_CC1/ARESETN] [get_bd_pins hier_pcie/M02_ARESETN]
connect_bd_net [get_bd_pins clk_wiz_0/locked] [get_bd_pins xlconcat_led/In1] [get_bd_pins hier_ddr/sys_rst]
connect_bd_net [get_bd_pins hier_pcie/user_lnk_up] [get_bd_pins xlconcat_led/In0]
connect_bd_net [get_bd_pins hier_ddr/init_calib_complete] [get_bd_pins xlconcat_led/In2]
connect_bd_net [get_bd_pins xlconcat_led/dout] [get_bd_pins Not_logic_led/Op1]
connect_bd_net [get_bd_pins Not_logic_led/Res] [get_bd_ports led]
connect_bd_net -net hier_CC_CMInitFinish [get_bd_pins hier_CC0/CMInitFinish] [get_bd_pins xlconcat_led/In3]
connect_bd_net [get_bd_pins hier_CC1/CMInitFinish] [get_bd_pins xlconcat_led/In4]
# net hier_pcie_axi_aclk has one end: hier_pcie/axi_aclk
# net hier_pcie_axi_aresetn has one end: hier_pcie/axi_aresetn
connect_bd_net [get_bd_pins hier_CC0/dout] [get_bd_pins hier_ddr/S00_AXI_araddr]
connect_bd_net [get_bd_pins hier_CC0/dout1] [get_bd_pins hier_ddr/S00_AXI_awaddr]
connect_bd_net [get_bd_pins hier_CC1/dout] [get_bd_pins hier_ddr/S01_AXI_araddr]
connect_bd_net [get_bd_pins hier_CC1/dout1] [get_bd_pins hier_ddr/S01_AXI_awaddr]

# ---- address map ----
assign_bd_address -offset 0x80000000 -range 1G -target_address_space [get_bd_addr_spaces hier_CC0/zpaq_fxa_CC/M00_AXI] [get_bd_addr_segs hier_ddr/ddr3_PowerSide/memmap/memaddr]
assign_bd_address -offset 0x80000000 -range 1G -target_address_space [get_bd_addr_spaces hier_CC1/zpaq_fxa_CC/M00_AXI] [get_bd_addr_segs hier_ddr/ddr3_PowerSide/memmap/memaddr]
assign_bd_address -offset 0x44A00000 -range 4K -target_address_space [get_bd_addr_spaces hier_pcie/xdma_pcie/M_AXI_LITE] [get_bd_addr_segs hier_CC0/CC_Control/S00_AXI/S00_AXI_reg]
assign_bd_address -offset 0x44A01000 -range 4K -target_address_space [get_bd_addr_spaces hier_pcie/xdma_pcie/M_AXI_LITE] [get_bd_addr_segs hier_CC1/CC_Control/S00_AXI/S00_AXI_reg]

validate_bd_design
save_bd_design
